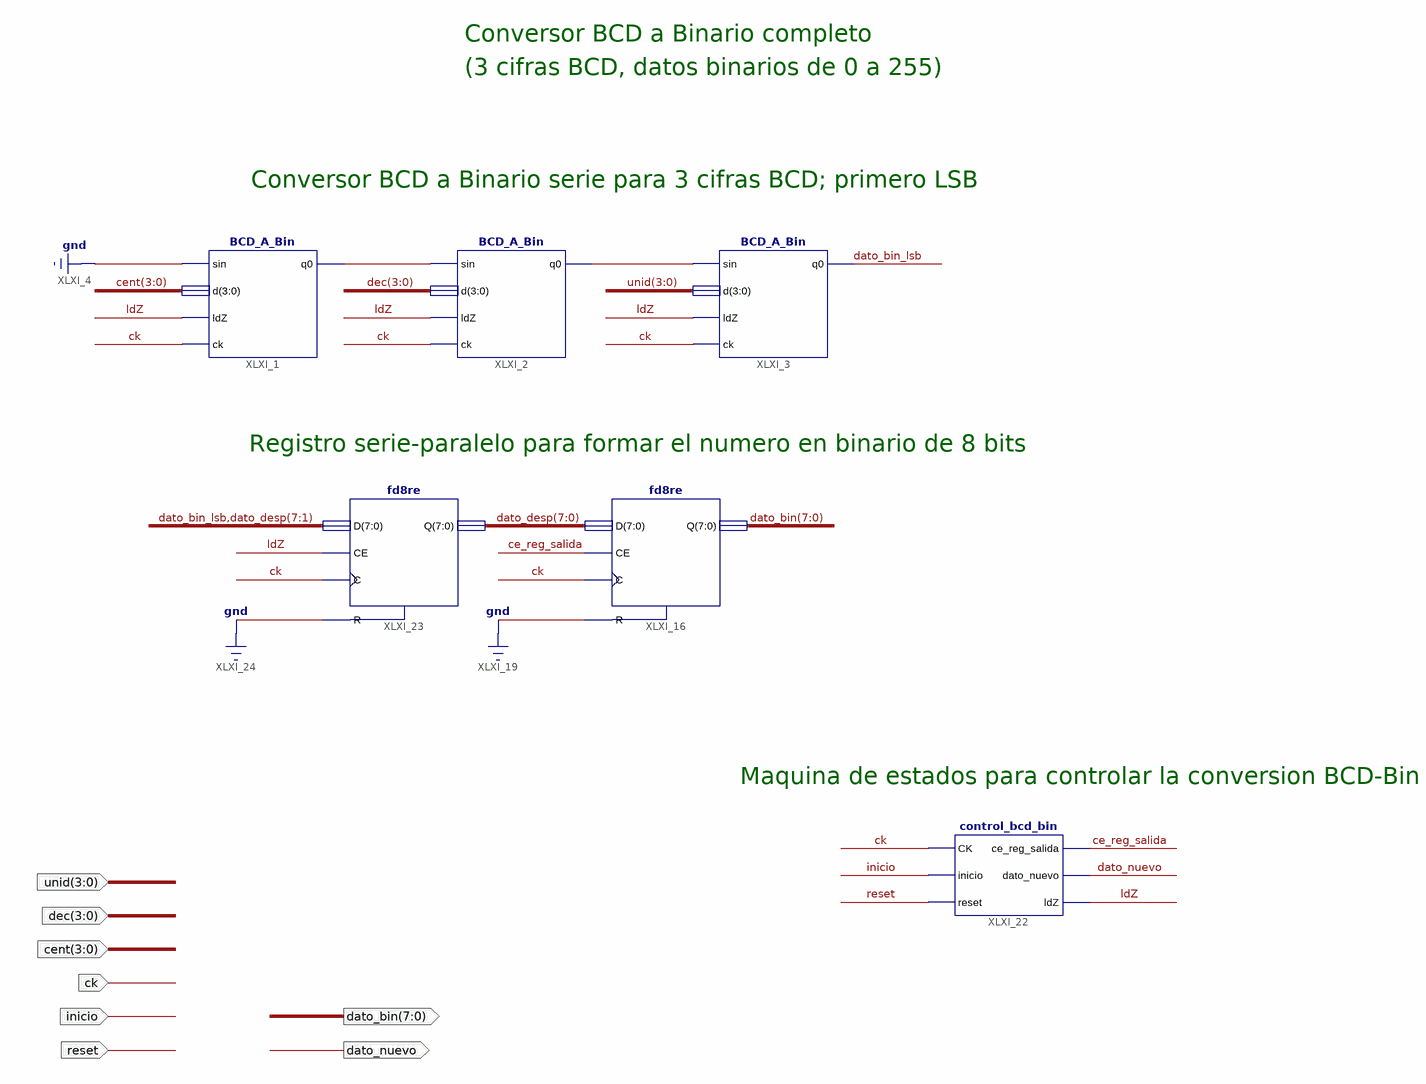
[diagram p0: schematic sheet 1]
// Xilinx ISE schematic Conversor_BCD_Bin.sch (spartan6) as structural Verilog: 6 symbols, 8 ports
module Conversor_BCD_Bin (
  input  [3:0] unid,
  input  [3:0] dec,
  input  [3:0] cent,
  input  ck,
  input  inicio,
  input  reset,
  output dato_nuevo,
  output [7:0] dato_bin
);

  wire ce_reg_salida, dato_bin_lsb, ldZ, XLXN_14, XLXN_15;
  wire [7:0] dato_desp;

  BCD_A_Bin XLXI_1 (.ck(ck), .ldZ(ldZ), .sin(1'b0), .d(cent), .q0(XLXN_14));
  BCD_A_Bin XLXI_3 (.ck(ck), .ldZ(ldZ), .sin(XLXN_15), .d(unid), .q0(dato_bin_lsb));
  BCD_A_Bin XLXI_2 (.ck(ck), .ldZ(ldZ), .sin(XLXN_14), .d(dec), .q0(XLXN_15));
  fd8re XLXI_16 (.C(ck), .CE(ce_reg_salida), .D(dato_desp), .R(1'b0), .Q(dato_bin));
  fd8re XLXI_23 (.C(ck), .CE(ldZ), .D({dato_bin_lsb, dato_desp[7:1]}), .R(1'b0), .Q(dato_desp));
  control_bcd_bin XLXI_22 (
    .CK(ck), .inicio(inicio), .reset(reset), .ce_reg_salida(ce_reg_salida), .dato_nuevo(dato_nuevo), .ldZ(ldZ));

  // Notes on the sheet:
  //   Conversor BCD a Binario completo
  //   (3 cifras BCD, datos binarios de 0 a 255)
  //   Conversor BCD a Binario serie para 3 cifras BCD; primero LSB
  //   Registro serie-paralelo para formar el numero en binario de 8 bits
  //   Maquina de estados para controlar la conversion BCD-Bin
endmodule
